# Altium schematic sheet cs301_template.SchDoc
size A4; SheetNumber: 1; SheetTotal: 2
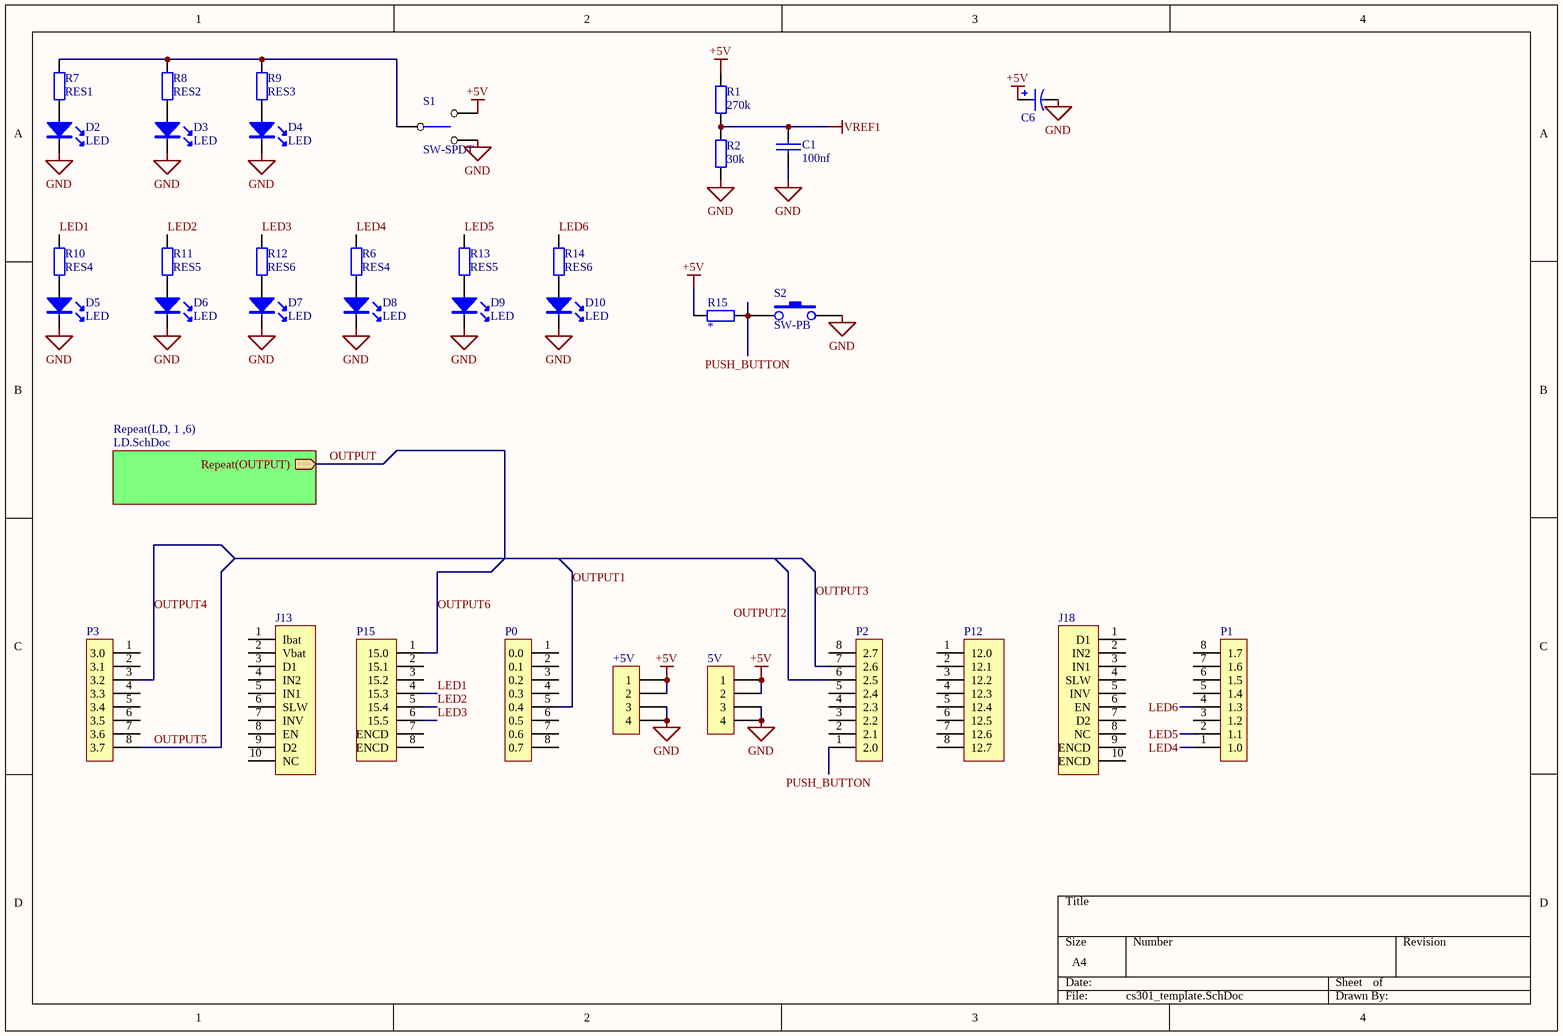
[diagram p0: cs301_template.SchDoc]

## Parts
5V  5V  [IDC4]  (value not drawn)
+5V  5V  [IDC4]  (value not drawn)
C1  100nf  [0805 CAP]
C6  *  [CAP POL 8x5.4mm SMT]  (value not drawn)
D2  LED  [LED0.1/5MM]
D3  LED  [LED0.1/5MM]
D4  LED  [LED0.1/5MM]
D5  LED  [LED0.1/5MM]
D6  LED  [LED0.1/5MM]
D7  LED  [LED0.1/5MM]
D8  LED  [LED0.1/5MM]
D9  LED  [LED0.1/5MM]
D10  LED  [LED0.1/5MM]
J13  CON10  [idc10]  (value not drawn)
J18  CON10  [IDC10]  (value not drawn)
P0  P0  [idc8]  (value not drawn)
P1  P1  [idc8]  (value not drawn)
P2  P2  [idc8]  (value not drawn)
P3  P3  [idc8]  (value not drawn)
P12  P12  [idc8]  (value not drawn)
P15  P15  [idc8]  (value not drawn)
R1  270k  [0805 RES]
R2  30k  [0805 RES]
R6  RES4  [0805 RES]
R7  RES1  [0805 RES]
R8  RES2  [0805 RES]
R9  RES3  [0805 RES]
R10  RES4  [0805 RES]
R11  RES5  [0805 RES]
R12  RES6  [0805 RES]
R13  RES5  [0805 RES]
R14  RES6  [0805 RES]
R15  *  [0805 RES]
S1  SW-SPDT  [SW-SPDT]
S2  SW-PB  [SW-PB]

## Sub-sheets
Repeat(LD, 1 ,6) = LD.SchDoc: Repeat(OUTPUT) (out)

## Nets
+5V: 5V.1 5V.2 +5V.1 +5V.2 C6.1 R1.2 R15.1 S1.1
GND: 5V.3 5V.4 +5V.3 +5V.4 C1.2 C6.2 D2.K D3.K D4.K D5.K D6.K D7.K D8.K D9.K D10.K R2.1 S1.3 S2.2
VREF1: C1.1 R1.1 R2.2
LED1: P15.4(15.3) R10.2
LED2: P15.5(15.4) R11.2
LED3: P15.6(15.5) R12.2
LED4: P1.1(1.0) R6.2
LED5: P1.2(1.1) R13.2
LED6: P1.4(1.3) R14.2
OUTPUT: sheet Repeat(LD, 1 ,6)/Repeat(OUTPUT)
OUTPUT1: P0.5(0.4)
OUTPUT2: P2.6(2.5)
OUTPUT3: P2.7(2.6)
OUTPUT4: P3.3(3.2)
OUTPUT5: P3.8(3.7)
OUTPUT6: P15.1(15.0)
PUSH_BUTTON: P2.1(2.0) R15.2 S2.1
NetD2_A: D2.A R7.1
NetD3_A: D3.A R8.1
NetD4_A: D4.A R9.1
NetD5_A: D5.A R10.1
NetD6_A: D6.A R11.1
NetD7_A: D7.A R12.1
NetD8_A: D8.A R6.1
NetD9_A: D9.A R13.1
NetD10_A: D10.A R14.1
NetR7_2: R7.2 R8.2 R9.2 S1.2

Not connected (* = marked no-connect by the designer): J13 1(Ibat) 2(Vbat) 3(D1) 4(IN2) 5(IN1) 6(SLW) 7(INV) 8(EN) 9(D2) 10(NC); J18 1(D1) 2(IN2) 3(IN1) 4(SLW) 5(INV) 6(EN) 7(D2) 8(NC) 9(ENCD) 10(ENCD); P0 1(0.0) 2(0.1) 3(0.2) 4(0.3) 6(0.5) 7(0.6) 8(0.7); P1 3(1.2) 5(1.4) 6(1.5) 7(1.6) 8(1.7); P2 2(2.1) 3(2.2) 4(2.3) 5(2.4) 8(2.7); P3 1(3.0) 2(3.1) 4(3.3) 5(3.4) 6(3.5) 7(3.6); P12 1(12.0) 2(12.1) 3(12.2) 4(12.3) 5(12.4) 6(12.5) 7(12.6) 8(12.7); P15 2(15.1) 3(15.2) 7(ENCD) 8(ENCD)

## Buses and harness runs
bus 

## Library data of the parts
5V +5V = CON4: Connector
C1 = CerCap_SMT_0805: SMT ceramic capacitor 0805 size; Value: *
C6 = ElecCap_SMT_8D0: CAP ALUM 22UF 20% 50V SMD (Model: UWX1H220MCL1GB); Manufacturer: Nichicon; Manufacturer Part Number: UWX1V220MCL1GB; Lifetime @ Temp.: 2000 Hrs @ 85°C; Polarization: Polar; Surface Mount Land Size: 0.260" L x 0.260" W (6.60mm x 6.60mm); Capacitance 1: 22 µF; Revision: July-2002: Re-released for DXP Platform.; RoHS: RoHS Compliant; Category: Capacitors; Stock 1: 680; Pricing 1: 1=0.59, 10=0.406, 100=0.2304, 500=0.16268 (NZD); Packaging: Cut Tape (CT); Part Status: Active; Tolerance: ±20%; ESR (Equivalent Series Resistance): -; Operating Temperature: -40°C ~ 85°C; Ratings: -; Applications: General Purpose; Lead Spacing: -; Size / Dimension: 0.248" Dia (6.30mm); Height - Seated (Max): 0.213" (5.40mm); Mounting Type: Surface Mount; Package / Case: Radial, Can - SMD; ComponentLink1URL: http://nichicon-us.com/english/products/pdfs/e-uwx.pdf; ComponentLink1Description: http://nichicon-us.com/english/products/pdfs/e-uwx.pdf; Supplier 1: Digi-Key; Supplier Part Number 1: 493-2136-1-ND; Value: *
J13 J18 = CON10: Connector
P0-P3 = CON8: Connector
P12 P15 = CON8_1: Connector
R1 R2 R6-R15 = Res_SMT_0805: 0805 resistor; Published: 8-Jun-2000; LatestRevisionDate: 17-Jul-2002; LatestRevisionNote: Re-released for DXP Platform.; PackageReference: AXIAL-0.4; Publisher: Altium Limited; Value: *; ComponentLink1Description: https://nz.mouser.com/datasheet/2/315/AOA0000C304-1149620.pdf
S1 = SW-SPDT: Toggle Switch
S2 = SW-PB: Push Button Switch